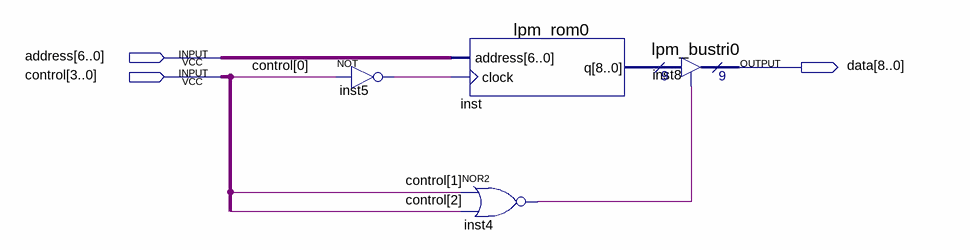
[diagram p0: schematic sheet]
// Quartus schematic ROM.bdf as structural Verilog: 4 symbols, 3 pins
module ROM (
  input  [6:0] address,
  input  [3:0] control,
  output [8:0] data
);

  wire inst4_out, inst5_out;
  wire [8:0] inst_q;

  not inst5 (inst5_out, control[0]);
  lpm_rom0 inst (.address(address), .clock(inst5_out), .q(inst_q));
  nor inst4 (inst4_out, control[1], control[2]);
  lpm_bustri0 inst8 (.enabledt(inst4_out), .data(inst_q), .tridata(data));
endmodule
